# Altium project LimeNet-Micro_2v1-SDR.PrjPcb (part 7 of 10)

## Sheet 14_Clocks.SchDoc: Clocks
size A3; Organization: Lime Microsystems; Address1: Surrey Tech Centre; Address2: Guildford GU2 7YG; Address3: Surrey; Address4: United Kingdom; Revision: v2.1; SheetNumber: 14; SheetTotal: 15
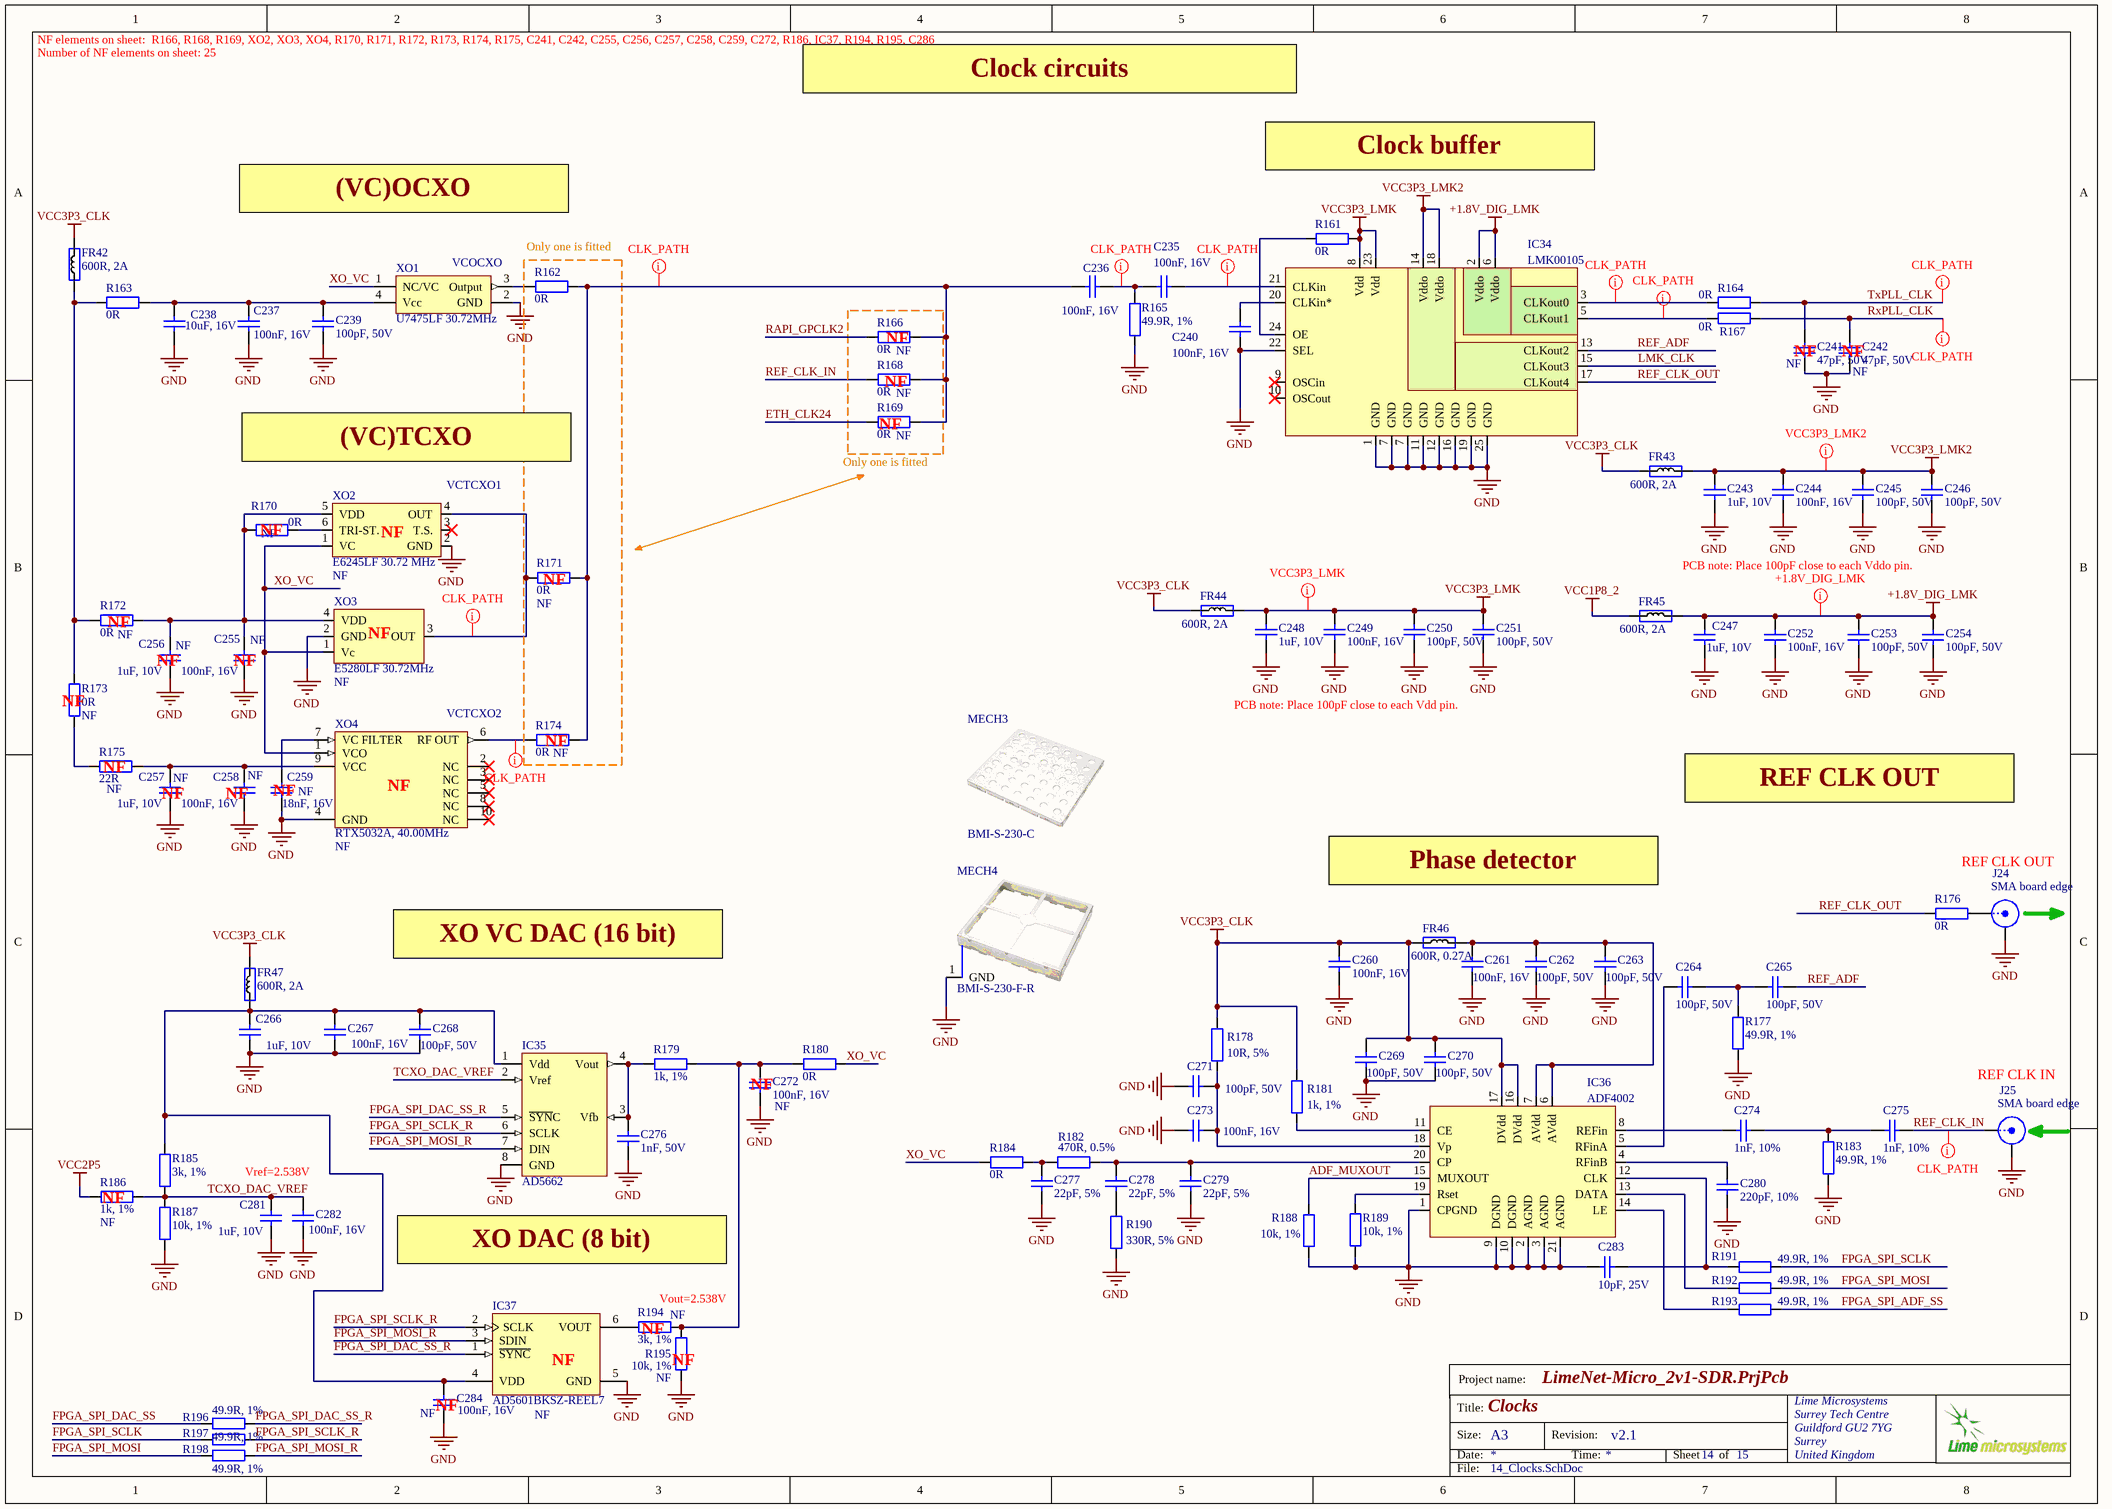
[diagram p13: 14_Clocks.SchDoc]

### Parts
C235  100nF, 16V  [CAP0402]
C236  100nF, 16V  [CAP0402]
C237  100nF, 16V  [CAP0402]
C238  10uF, 16V  [CAP0603]
C239  100pF, 50V  [CAP0402]
C240  100nF, 16V  [CAP0402]
C241  47pF, 50V  Assembly Info: NF  [CAP0402]
C242  47pF, 50V  Assembly Info: NF  [CAP0402]
C243  1uF, 10V  [CAP0402]
C244  100nF, 16V  [CAP0402]
C245  100pF, 50V  [CAP0402]
C246  100pF, 50V  [CAP0402]
C247  1uF, 10V  [CAP0402]
C248  1uF, 10V  [CAP0402]
C249  100nF, 16V  [CAP0402]
C250  100pF, 50V  [CAP0402]
C251  100pF, 50V  [CAP0402]
C252  100nF, 16V  [CAP0402]
C253  100pF, 50V  [CAP0402]
C254  100pF, 50V  [CAP0402]
C255  100nF, 16V  Assembly Info: NF  [CAP0402]
C256  1uF, 10V  Assembly Info: NF  [CAP0402]
C257  1uF, 10V  Assembly Info: NF  [CAP0402]
C258  100nF, 16V  Assembly Info: NF  [CAP0402]
C259  18nF, 16V  Assembly Info: NF  [CAP0402]
C260  100nF, 16V  [CAP0402]
C261  100nF, 16V  [CAP0402]
C262  100pF, 50V  [CAP0402]
C263  100pF, 50V  [CAP0402]
C264  100pF, 50V  [CAP0402]
C265  100pF, 50V  [CAP0402]
C266  1uF, 10V  [CAP0402]
C267  100nF, 16V  [CAP0402]
C268  100pF, 50V  [CAP0402]
C269  100pF, 50V  [CAP0402]
C270  100pF, 50V  [CAP0402]
C271  100pF, 50V  [CAP0402]
C272  100nF, 16V  Assembly Info: NF  [CAP0402]
C273  100nF, 16V  [CAP0402]
C274  1nF, 10%  [CAP0402]
C275  1nF, 10%  [CAP0402]
C276  1nF, 50V  [CAP0402]
C277  22pF, 5%  [CAP0402]
C278  22pF, 5%  [CAP0402]
C279  22pF, 5%  [CAP0402]
C280  220pF, 10%  [CAP0402]
C281  1uF, 10V  [CAP0402]
C282  100nF, 16V  [CAP0402]
C283  10pF, 25V  [CAP0402]
C284  100nF, 16V  Assembly Info: NF  [CAP0402]
FR42  600R, 2A  [RES0805]
FR43  600R, 2A  [RES0805]
FR44  600R, 2A  [RES0805]
FR45  600R, 2A  [RES0805]
FR46  600R, 0.27A  [RES0201]
FR47  600R, 2A  [RES0805]
IC34  LMK00105  [LMK00105SQ]
IC35  AD5662  [AD5662_SOT23-8]
IC36  ADF4002  [ADF4002]
IC37  AD5601BKSZ-REEL7  Assembly Info: NF  [AD5601_SOT23-6]
J24  SMA board edge  [SMA_connector_board_edge_SM]
J25  SMA board edge  [SMA_connector_board_edge_SM]
MECH3  BMI-S-230-C  (mechanical)
MECH4  BMI-S-230-F-R  [RFI_SHIELD_BMI-S-230-F-R]
R161  0R  [RES0402]
R162  0R  [RES0402_v2]
R163  0R  [RES0402]
R164  0R  [RES0402]
R165  49.9R, 1%  [RES0402]
R166  0R  Assembly Info: NF  [RES0402_v2]
R167  0R  [RES0402]
R168  0R  Assembly Info: NF  [RES0402_v2]
R169  0R  Assembly Info: NF  [RES0402_v2]
R170  0R  Assembly Info: NF  [RES0402]
R171  0R  Assembly Info: NF  [RES0402_v2]
R172  0R  Assembly Info: NF  [RES0402]
R173  0R  Assembly Info: NF  [RES0402]
R174  0R  Assembly Info: NF  [RES0402_v2]
R175  22R  Assembly Info: NF  [RES0402]
R176  0R  [RES0402]
R177  49.9R, 1%  [RES0402]
R178  10R, 5%  [RES0402]
R179  1k, 1%  [RES0402]
R180  0R  [RES0402]
R181  1k, 1%  [RES0402]
R182  470R, 0.5%  [RES0402]
R183  49.9R, 1%  [RES0402]
R184  0R  [RES0402]
R185  3k, 1%  [RES0402]
R186  1k, 1%  Assembly Info: NF  [RES0402]
R187  10k, 1%  [RES0402]
R188  10k, 1%  [RES0402]
R189  10k, 1%  [RES0402]
R190  330R, 5%  [RES0402]
R191  49.9R, 1%  [RES0402]
R192  49.9R, 1%  [RES0402]
R193  49.9R, 1%  [RES0402]
R194  3k, 1%  Assembly Info: NF  [RES0402]
R195  10k, 1%  Assembly Info: NF  [RES0402]
R196  49.9R, 1%  [RES0402]
R197  49.9R, 1%  [RES0402]
R198  49.9R, 1%  [RES0402]
XO1  U7475LF 30.72MHz  [AOCJYR-10.000MHz]
XO2  E6245LF 30.72 MHz  Assembly Info: NF  [RAKON_RPT7050A]
XO3  E5280LF 30.72MHz  Assembly Info: NF  [RAKON_TXCO]
XO4  RTX5032A, 40.00MHz  Assembly Info: NF  [RAKON_RTX5032A]

### Blocks framed on the sheet
Only one is fitted: R162 R171 R174

### Nets
+1.8V_DIG_LMK: C247.2 C252.2 C253.2 C254.2 FR45.2 IC34.2(Vddo) IC34.6(Vddo)
GND: C237.1 C238.1 C239.2 C240.1 C241.1 C242.1 C243.1 C244.1 C245.1 C246.1 C247.1 C248.1 C249.1 C250.1 C251.1 C252.1 C253.1 C254.1 C255.1 C256.1 C257.1 C258.1 C259.1 C260.1 C261.1 C262.2 C263.2 C266.1 C267.2 C268.2 C269.2 C270.2 C271.1 C272.1 C273.2 C276.2 C277.1 C279.1 C280.2 C281.1 C282.2 C283.1 C284.2 IC34.1(GND) IC34.7(GND) IC34.11(GND) IC34.12(GND) IC34.16(GND) IC34.19(GND) IC34.22(SEL) IC34.25(GND) IC35.8(GND) IC36.1(CPGND) IC36.2(AGND) IC36.3(AGND) IC36.9(DGND) IC36.10(DGND) IC36.21(AGND) IC37.5(GND) J24.2(Y) J25.2(Y) MECH4.1(GND) R165.1 R177.1 R183.1 R187.2 R188.2 R189.2 R190.1 R195.2 XO1.2(GND) XO2.2(GND) XO3.2(GND) XO4.4(GND)
VCC1P8_2: FR45.1
VCC2P5: R186.2
VCC3P3_CLK: C260.2 C269.1 C270.1 FR42.1 FR43.1 FR44.1 FR46.1 FR47.2 IC36.16(DVdd) IC36.17(DVdd) R178.2 R181.2
VCC3P3_LMK: C248.2 C249.2 C250.2 C251.2 FR44.2 IC34.8(Vdd) IC34.23(Vdd) R161.2
VCC3P3_LMK2: C243.2 C244.2 C245.2 C246.2 FR43.2 IC34.14(Vddo) IC34.18(Vddo)
ADF_MUXOUT: IC36.15(MUXOUT) R188.1
ETH_CLK24: R169.2
FPGA_SPI_ADF_SS: R193.1
FPGA_SPI_DAC_SS: R196.2
FPGA_SPI_DAC_SS_R: IC35.5(~{SYN}C) IC37.1(~{SYNC}) R196.1
FPGA_SPI_MOSI: R192.1 R198.2
FPGA_SPI_MOSI_R: IC35.7(DIN) IC37.3(SDIN) R198.1
FPGA_SPI_SCLK: R191.1 R197.2
FPGA_SPI_SCLK_R: IC35.6(SCLK) IC37.2(SCLK) R197.1
LMK_CLK: IC34.15(CLKout3)
RAPI_GPCLK2: R166.2
REF_ADF: C265.2 IC34.13(CLKout2)
REF_CLK_IN: C275.1 J25.1(X) R168.2
REF_CLK_OUT: IC34.17(CLKout4) R176.2
RxPLL_CLK: C242.2 R167.1
TCXO_DAC_VREF: C281.2 C282.1 IC35.2(Vref) R185.1 R186.1 R187.1
TxPLL_CLK: C241.2 R164.1
XO_VC: R180.1 R184.2 XO1.1(NC/VC) XO2.1(VC) XO3.1(Vc) XO4.1(VCO)
NetC235_1: C235.1 IC34.21(CLKin)
NetC235_2: C235.2 C236.1 R165.2
NetC236_2: C236.2 R162.1 R166.1 R168.1 R169.1 R171.1 R174.2
NetC237_2: C237.2 C238.2 C239.1 R163.2 XO1.4(Vcc)
NetC240_2: C240.2 IC34.20(CLKin*)
NetC255_2: C255.2 C256.2 R170.2 R172.1 XO2.5(VDD) XO3.4(VDD)
NetC257_2: C257.2 C258.2 R175.2 XO4.9(VCC)
NetC259_2: C259.2 XO4.7(VC_FILTER)
NetC261_2: C261.2 C262.1 C263.1 FR46.2 IC36.6(AVdd) IC36.7(AVdd)
NetC264_1: C264.1 IC36.5(RFinA)
NetC264_2: C264.2 C265.1 R177.2
NetC266_2: C266.2 C267.1 C268.1 C284.1 FR47.1 IC35.1(Vdd) IC37.4(VDD) R185.2
NetC271_2: C271.2 C273.1 IC36.18(Vp) R178.1
NetC272_2: C272.2 R179.1 R180.2 R194.1 R195.1
NetC274_1: C274.1 C275.2 R183.2
NetC274_2: C274.2 IC36.8(REFin)
NetC276_1: C276.1 IC35.3(Vfb) IC35.4(Vout) R179.2
NetC277_2: C277.2 R182.2 R184.1
NetC278_1: C278.1 R190.2
NetC278_2: C278.2 C279.2 IC36.20(CP) R182.1
NetC280_1: C280.1 IC36.4(RFinB)
NetC283_2: C283.2 IC36.12(CLK) R191.2
NetFR42_2: FR42.2 R163.1 R172.2 R173.1
NetIC34_3: IC34.3(CLKout0) R164.2
NetIC34_5: IC34.5(CLKout1) R167.2
NetIC34_24: IC34.24(OE) R161.1
NetIC36_11: IC36.11(CE) R181.1
NetIC36_13: IC36.13(DATA) R192.2
NetIC36_14: IC36.14(LE) R193.2
NetIC36_19: IC36.19(Rset) R189.1
NetIC37_6: IC37.6(VOUT) R194.2
NetJ24_1: J24.1(X) R176.1
NetR162_2: R162.2 XO1.3(Output)
NetR170_1: R170.1 XO2.6(TRI-ST.)
NetR171_2: R171.2 XO2.4(OUT) XO3.3(OUT)
NetR173_2: R173.2 R175.1
NetR174_1: R174.1 XO4.6(RF_OUT)

Not connected (* = marked no-connect by the designer): IC34 9(OSCin)* 10(OSCout)*; XO2 3(T.S.)*; XO4 2(NC)* 3(NC)* 5(NC)* 8(NC)* 10(NC)*

### Layout directives
net class CLK_PATH: NetC235_1, NetC235_2, NetC236_2, NetIC34_3, NetIC34_5, NetR171_2, NetR174_1, REF_CLK_IN, RxPLL_CLK, TxPLL_CLK
net class VCC3P3_LMK2: VCC3P3_LMK2
net class VCC3P3_LMK: VCC3P3_LMK
net class +1.8V_DIG_LMK: +1.8V_DIG_LMK

### Notes on the sheet
- NF elements on sheet:  R166, R168, R169, XO2, XO3, XO4, R170, R171, R172, R173, R174, R175, C241, C242, C255, C256, C257, C258, C259, C272, R186, IC37, R194, R195, C286
- Number of NF elements on sheet: 25
- Clock circuits
- Clock buffer
- (VC)OCXO
- (near XO1) VCOCXO
- (near R166) NF
- (near C241) NF
- (near C242) NF
- (near R169) NF
- (near R168) NF
- (VC)TCXO
- (near XO2) VCTCXO1
- (near R169) Only one is fitted
- (near R170) NF
- (near XO2) NF
- (near R171) NF
- PCB note: Place 100pF close to each Vddo pin.
- (near R172) NF
- (near XO3) NF
- (near R173) NF
- (near C256) NF
- (near C255) NF
- (near XO4) VCTCXO2
- PCB note: Place 100pF close to each Vdd pin.
- (near R175) NF
- (near R174) NF
- (near C257) NF
- (near C258) NF
- (near C259) NF
- (near XO4) NF
- REF CLK OUT
- Phase detector
- XO VC DAC (16 bit)
- (near C272) NF
- (near J25) REF CLK IN
- Vref=2.538V
- (near R186) NF
- XO DAC (8 bit)
- Vout=2.538V
- (near IC37) NF
- NF
- (near R195) NF
- (near C284) NF
- Project name:
- Title:
- Size:
- Date:
- A3
- Revision:
- Time:
- Sheet
- of
- File:

### Library data of the parts
C235-C237 C240 C244 C249 C252 C255 C258 C260 C261 C272 C273 = Cap_0402: Manufacturer: Murata Electronics; Manufacturer Part Number: GRM155R71C104KA88D; Part Description: CAP CER 0.1UF 16V X7R 0402; Tolerance: 10 %; Type: General Purpose MLCC; Capacitance: 0.1 uF; Case Length: 1 mm; Dielectric: X7R; Case Height: 0.5 mm; Temperature Coefficient / Code: +/- 15 %; Value: 100nF, 16V; Supplier 1: Mouser; Supplier Part Number 1: 81-GRM155R71C104KA88; Case Code - in: 0402; RoHS: RoHS Compliant; Operating Temperature Range: - 55 C to + 125 C; Series: GRM; Termination Style: SMD/SMT; Package / Case: 0402 (1005 metric); Voltage Rating DC: 16 V; Maximum Operating Temperature: + 125 C; Case Code - mm: 1005; Minimum Operating Temperature: - 55 C; Product Category: Low & Medium Capacitance SMD Ceramic Chip Capacitors; Packaging: Reel; Product: General Type MLCCs; Category: Multilayer Ceramic Capacitors MLCC - SMD/SMT; Brand: Murata Electronics; Case Width: 0.5 mm; RoHS - Mouser: Y; Standard Pack Qty: 10000; Minimum Order Quantity: 1; Reeling: True; Manufacturer Part Number 1: GRM155R71C104KA88D
C238 = Cap_0603: Manufacturer: Yageo; Manufacturer Part Number 1: GRM188R61C106MA73D; Part Description: 10µF ±20% 16V Ceramic Capacitor X5R 0603 (1608 Metric); Temperature Coefficient: X5R; Capacitance: 10µF; Tolerance: ±20%; Value: 10uF, 16V; Supplier 1: Digi-Key; Supplier Part Number 1: 490-7201-2-ND; Category: Capacitors; Ratings: -; Features: -; Lead Style: -; Package / Case: 0603 (1608 Metric); Lead Spacing: -; Applications: General Purpose; Voltage - Rated: 16V; Operating Temperature: -55°C ~ 85°C; Thickness (Max): 0.039" (1.00mm); Mounting Type: Surface Mount, MLCC; RoHS: RoHS Compliant; Size / Dimension: 0.063" L x 0.031" W (1.60mm x 0.80mm); Packaging: Tape & Reel (TR); Height - Seated (Max): -
C239 = Cap_0402: Manufacturer Part Number 1: CC0402JRNPO9BN101; Manufacturer: Yageo; Part Description: 100pF ±5% 50V C0G, NP0 Ceramic Capacitor -55°C ~ 125°C Surface Mount, MLCC 0402 (1005 Metric) 0.039" L x 0.020" W (1.00mm x 0.50mm); Tolerance: ±5%; Temperature Coefficient: C0G, NP0; Value: 100pF, 50V; Capacitance: 100pF; Thickness (Max): 0.022" (0.55mm); Size / Dimension: 0.039" L x 0.020" W (1.00mm x 0.50mm); RoHS: RoHS Compliant; Ratings: -; Package / Case: 0402 (1005 Metric); Mounting Type: Surface Mount, MLCC; Height - Seated (Max): -; Features: -; Lead Spacing: -; Voltage - Rated: 50V; Operating Temperature: -55°C ~ 125°C; Packaging: Cut Tape (CT); Applications: General Purpose; Lead Style: -; Supplier 1: Digi-Key; Category: Capacitors; Supplier Part Number 1: 311-1024-1-ND
C241 C242 = Cap_0402: Manufacturer Part Number 1: C1005C0G1H470F050BA; Manufacturer: TDK Corporation; Part Description: 47pF ±1% 50V C0G, NP0 Ceramic Capacitor -55°C ~ 125°C Surface Mount, MLCC 0402 (1005 Metric) 0.039" L x 0.020" W (1.00mm x 0.50mm); Temperature Coefficient: C0G, NP0; Tolerance: ±1%; Value: 47pF, 50V; Supplier 1: Digi-Key; Supplier Part Number 1: 445-5361-1-ND; Package / Case: 0402 (1005 Metric); Voltage - Rated: 50V; Lead Spacing: -; Ratings: -; Mounting Type: Surface Mount, MLCC; Operating Temperature: -55°C ~ 125°C; Thickness (Max): 0.022" (0.55mm); Capacitance: 47pF; Packaging: Cut Tape (CT); Features: -; Applications: General Purpose; Lead Style: -; Size / Dimension: 0.039" L x 0.020" W (1.00mm x 0.50mm); Height - Seated (Max): -; RoHS: RoHS Compliant; Category: Capacitors
C243 C247 C248 C256 C257 C266 C281 = Cap_0402: CAP CER 1UF 10V X5R 0402; Manufacturer: Yageo; Part Description: 1µF 10V Ceramic Capacitor X5R 0402 (1005 Metric) 0.039" L x 0.020" W (1.00mm x 0.50mm); Manufacturer Part Number 1: CC0402MRX5R6BB105; Notification: Current market demand for these product types have resulted in fluctuating and extending lead times. Lead times may differ.; Tolerance: ±20%; Value: 1uF, 10V; Supplier 1: Digi-Key; Supplier Part Number 1: 311-1732-1-ND; RoHS: RoHS Compliant; Applications: General Purpose; Category: Capacitors; ComponentLink1Description: http://www.yageo.com/documents/recent/UPY-GPHC_X5R_4V-to-50V_25.pdf; ComponentLink1URL: http://www.yageo.com/documents/recent/UPY-GPHC_X5R_4V-to-50V_25.pdf; Failure Rate: -; Features: -; Height - Seated (Max): -; Lead Spacing: -; Lead Style: -; Mounting Type: Surface Mount, MLCC; Operating Temperature: -55°C ~ 85°C; Package / Case: 0402 (1005 Metric); Packaging: Cut Tape (CT); Part Status: Active; Pricing 1: 1=0.22, 10=0.156, 100=0.0732, 500=0.0513, 1000=0.04248, 2500=0.03953, 5000=0.03617 (USD); Ratings: -; Size / Dimension: 0.039" L x 0.020" W (1.00mm x 0.50mm); Stock 1: 69600; Temperature Coefficient: X5R; Thickness (Max): 0.022" (0.55mm); Voltage - Rated: 10V
C245 C246 C250 C251 C253 C254 = Cap_0402: Manufacturer Part Number 1: CC0402JRNPO9BN101; Manufacturer: Yageo; Part Description: 100pF ±5% 50V C0G, NP0 Ceramic Capacitor -55°C ~ 125°C Surface Mount, MLCC 0402 (1005 Metric) 0.039" L x 0.020" W (1.00mm x 0.50mm); Temperature Coefficient: C0G, NP0; Tolerance: ±5%; Value: 100pF, 50V; Supplier 1: Digi-Key; Supplier Part Number 1: 311-1024-1-ND; RoHS: RoHS Compliant; Category: Capacitors; Applications: General Purpose; Mounting Type: Surface Mount, MLCC; Capacitance: 100pF; Ratings: -; Packaging: Cut Tape (CT); Voltage - Rated: 50V; Size / Dimension: 0.039" L x 0.020" W (1.00mm x 0.50mm); Height - Seated (Max): -; Package / Case: 0402 (1005 Metric); Operating Temperature: -55°C ~ 125°C; Features: -; Lead Spacing: -; Lead Style: -; Thickness (Max): 0.022" (0.55mm)
C259 = Cap_0402: Manufacturer: Yageo; Manufacturer Part Number 1: CC0402KRX7R7BB183; Part Description: 0.018µF ±10% 16V Ceramic Capacitor X7R 0402 (1005 Metric); Temperature Coefficient: X7R; Capacitance: 0.018µF; Tolerance: ±10%; Value: 18nF, 16V; Supplier 1: Digi-Key; Supplier Part Number 1: 311-1706-1-ND; Part Status: Active; Category: Capacitors; Packaging: Cut Tape (CT); Voltage - Rated: 16V; RoHS: RoHS Compliant; Size / Dimension: 0.039" L x 0.020" W (1.00mm x 0.50mm); Package / Case: 0402 (1005 Metric); Mounting Type: Surface Mount, MLCC; Thickness (Max): 0.022" (0.55mm); Applications: General Purpose; Operating Temperature: -55°C ~ 125°C
C262-C265 C268-C271 = Cap_0402: Manufacturer: Yageo; Manufacturer Part Number 1: CC0402JRNPO9BN101; Part Description: 100pF ±5% 50V C0G, NP0 Ceramic Capacitor -55°C ~ 125°C Surface Mount, MLCC 0402 (1005 Metric) 0.039" L x 0.020" W (1.00mm x 0.50mm); Temperature Coefficient: C0G, NP0; Tolerance: ±5%; Value: 100pF, 50V; Supplier 1: Digi-Key; Supplier Part Number 1: 311-1024-1-ND; Category: Capacitors; Features: -; Operating Temperature: -55°C ~ 125°C; Capacitance: 100pF; Thickness (Max): 0.022" (0.55mm); RoHS: RoHS Compliant; Voltage - Rated: 50V; Lead Style: -; Ratings: -; Size / Dimension: 0.039" L x 0.020" W (1.00mm x 0.50mm); Height - Seated (Max): -; Applications: General Purpose; Package / Case: 0402 (1005 Metric); Lead Spacing: -; Packaging: Cut Tape (CT); Mounting Type: Surface Mount, MLCC
C267 C282 = Cap_0603: Manufacturer Part Number 1: GRM155R71C104KA88D; Part Description: CAP CER 0.1UF 16V X7R 0402; Brand: Murata Electronics; Tolerance: 10 %; Type: General Purpose MLCC; Capacitance: 0.1 uF; Temperature Coefficient / Code: +/- 15 %; Case Height: 0.5 mm; Case Length: 1 mm; Dielectric: X7R; Supplier 1: Mouser; Supplier Part Number 1: 81-GRM155R71C104KA88; Case Code - in: 0402; Manufacturer: Murata Electronics; Category: Multilayer Ceramic Capacitors MLCC - SMD/SMT; Voltage Rating DC: 16 V; Value: 100nF, 16V; Manufacturer Part Number: GRM155R71C104KA88D; Case Code - mm: 1005; Case Width: 0.5 mm; Maximum Operating Temperature: + 125 C; Minimum Operating Temperature: - 55 C; Minimum Order Quantity: 1; Operating Temperature Range: - 55 C to + 125 C; Package / Case: 0402 (1005 metric); Packaging: Reel; Product: General Type MLCCs; Product Category: Low & Medium Capacitance SMD Ceramic Chip Capacitors; Reeling: True; RoHS - Mouser: Y; RoHS: RoHS Compliant; Series: GRM; Standard Pack Qty: 10000; Termination Style: SMD/SMT
C274 C275 = Cap_0402: Manufacturer Part Number 1: GCM155R71H102KA37D; Part Description: 1000pF ±10% 50V X7R Ceramic Capacitor -55°C ~ 125°C Surface Mount, MLCC 0402 (1005 Metric) 0.039" L x 0.020" W (1.00mm x 0.50mm); Capacitance: 1000 pF; Type: Automotive Ultra Small MLCC; Brand: Murata Electronics; Case Height: 0.5 mm; Case Length: 1 mm; Dielectric: X7R; Voltage Rating DC: 50 V; Temperature Coefficient / Code: +/- 15 %; Value: 1nF, 10%; Supplier 1: Mouser; Supplier Part Number 1: 81-GCM155R71H102KA7D; Case Code - in: 0402; Package / Case: 0402 (1005 metric); Tolerance: 10 %; Termination Style: SMD/SMT; Packaging: Reel; Operating Temperature Range: - 55 C to + 125 C; Maximum Operating Temperature: + 125 C; Manufacturer: Murata Electronics; Category: Multilayer Ceramic Capacitors MLCC - SMD/SMT; RoHS: RoHS Compliant; Series: GCM; Case Width: 0.5 mm; Case Code - mm: 1005; Product: Automotive MLCCs; Standard Pack Qty: 10000; Reeling: True; RoHS - Mouser: Y; Minimum Order Quantity: 1; Product Category: Automotive Ceramic Chip Capacitors; Minimum Operating Temperature: - 55 C
C276 = Cap_0402: Manufacturer: Murata Electronics North America; Part Description: 1000pF ±10% 50V Ceramic Capacitor X7R 0402 (1005 Metric); Manufacturer Part Number 1: GCM155R71H102KA37D; Temperature Coefficient: X7R; Tolerance: ±10%; Height - Seated (Max): -; Operating Temperature: -55°C ~ 125°C; Ratings: AEC-Q200; Package / Case: 0402 (1005 Metric); Lead Style: -; Size / Dimension: 0.039" L x 0.020" W (1.00mm x 0.50mm); Lead Spacing: -; Thickness (Max): 0.022" (0.55mm); Mounting Type: Surface Mount, MLCC; Features: -; Voltage - Rated: 50V; Applications: Automotive; Part Status: Active; Packaging: Cut Tape (CT); RoHS: RoHS Compliant; Category: Capacitors; Supplier Part Number 1: 490-4761-1-ND; Supplier 1: Digi-Key; Value: 1nF, 50V
C277-C279 = Cap_0402: Manufacturer: Yageo; Manufacturer Part Number 1: CC0402JRNPO9BN220; Part Description: 22pF ±5% 50V C0G, NP0 Ceramic Capacitor -55°C ~ 125°C Surface Mount, MLCC 0402 (1005 Metric) 0.039" L x 0.020" W (1.00mm x 0.50mm); Voltage - Rated: 50V; Temperature Coefficient: C0G, NP0; Value: 22pF, 5%; Supplier 1: Digi-Key; Supplier Part Number 1: 311-1018-2-ND; Tolerance: ±5%; Category: Capacitors; Packaging: Tape & Reel (TR); RoHS: RoHS Compliant; Capacitance: 22pF; Operating Temperature: -55°C ~ 125°C; Mounting Type: Surface Mount, MLCC; Height - Seated (Max): -; Size / Dimension: 0.039" L x 0.020" W (1.00mm x 0.50mm); Ratings: -; Applications: General Purpose; Thickness (Max): 0.022" (0.55mm); Lead Spacing: -; Lead Style: -; Features: -; Package / Case: 0402 (1005 Metric)
C280 = Cap_0402: Manufacturer Part Number 1: CC0402KRX7R9BB221; Manufacturer: Yageo; Part Description: 220pF ±10% 50V X7R Ceramic Capacitor -55°C ~ 125°C Surface Mount, MLCC 0402 (1005 Metric) 0.039" L x 0.020" W (1.00mm x 0.50mm); Temperature Coefficient: X7R; Voltage - Rated: 50V; Value: 220pF, 10%; Supplier 1: Digi-Key; Supplier Part Number 1: 311-1035-2-ND; Category: Capacitors; Ratings: -; RoHS: RoHS Compliant; Packaging: Tape & Reel (TR); Mounting Type: Surface Mount, MLCC; Applications: General Purpose; Capacitance: 220pF; Tolerance: ±10%; Operating Temperature: -55°C ~ 125°C; Package / Case: 0402 (1005 Metric); Lead Spacing: -; Size / Dimension: 0.039" L x 0.020" W (1.00mm x 0.50mm); Thickness (Max): 0.022" (0.55mm); Height - Seated (Max): -; Lead Style: -; Features: -
C283 = Cap_0402: Manufacturer Part Number 1: 04023A100JAT2A; Manufacturer: AVX; Part Description: 10pF ±5% 25V C0G, NP0 Ceramic Capacitor -55°C ~ 125°C Surface Mount, MLCC 0402 (1005 Metric) 0.039" L x 0.020" W (1.00mm x 0.50mm); Capacitance Tolerance: ± 5%; Voltage Rating: 25; Ceramic Capacitor Case: 0402 [1005 Metric]; Capacitor Case Style: 0402 [1005 Metric]<!--FANDB--><div class="features-and-benefits-container"></div>; Dielectric Characteristic: C0G / NP0; SVHC: No SVHC (16-Jun-2014); Capacitance: 10; Value: 10pF, 25V; Supplier 1: Farnell; Supplier Part Number 1: 2332478RL; Product Range: -; RoHS: YES; Operating Temperature Min: -55; Operating Temperature Max: 125; Capacitance Tolerance ±: ± 5%; MSL: MSL 1 - Unlimited; Packaging: Cut Tape
C284 = Cap_0603: as C212 on sheet 13_Raspberry_Misc; Supplier 1: Mouser; Supplier Part Number 1: 81-GRM155R71C104KA88; Case Code - in: 0402; Manufacturer: Murata Electronics; Category: Multilayer Ceramic Capacitors MLCC - SMD/SMT; Voltage Rating DC: 16 V; Value: 100nF, 16V; Manufacturer Part Number: GRM155R71C104KA88D
FR42 = Ferrite: Manufacturer Part Number 1: MPZ2012S601AT000; Manufacturer: TDK Corporation; Part Description: FERRITE BEAD 600 OHM 0805 1LN; DC Resistance (DCR): 100 mOhm Max; Filter Type: Differential Mode - Single; Impedance @ Frequency: 600 Ohm @ 100MHz; Supplier 1: Digi-Key; Supplier Part Number 1: 445-2206-2-ND; Value: 600R, 2A; Category: Filters; Current Rating: 2A; Height (Max): 0.041" (1.05mm); Mounting Type: Surface Mount; Package / Case: 0805 (2012 Metric); Packaging: Tape & Reel (TR); RoHS: RoHS Compliant; Size / Dimension: 0.079" L x 0.049" W (2.00mm x 1.25mm)
FR43-FR45 FR47 = Ferrite: Manufacturer Part Number 1: MPZ2012S601AT000; Manufacturer: TDK Corporation; Part Description: FERRITE BEAD 600 OHM 0805 1LN; Filter Type: Differential Mode - Single; Impedance @ Frequency: 600 Ohm @ 100MHz; DC Resistance (DCR): 100 mOhm Max; Supplier 1: Digi-Key; Supplier Part Number 1: 445-2206-2-ND; Mounting Type: Surface Mount; RoHS: RoHS Compliant; Height (Max): 0.041" (1.05mm); Packaging: Tape & Reel (TR); Category: Filters; Current Rating: 2A; Package / Case: 0805 (2012 Metric); Size / Dimension: 0.079" L x 0.049" W (2.00mm x 1.25mm); Value: 600R, 2A
FR46 = Ferrite: Manufacturer Part Number 1: BK0603TS601-T; Manufacturer: Taiyo Yuden; Part Description: FERRITE BEAD 600 OHM 0201 1LN; DC Resistance (DCR): 750 mOhm Max; Filter Type: Differential Mode - Single; Impedance @ Frequency: 600 Ohm @ 100MHz; Current Rating: 270mA; Supplier 1: Digi-Key; Supplier Part Number 1: 587-3277-1-ND; Size / Dimension: 0.024" L x 0.012" W (0.60mm x 0.30mm); Package / Case: 0201 (0603 Metric); Height (Max): 0.013" (0.33mm); Mounting Type: Surface Mount; Packaging: Cut Tape (CT); RoHS: RoHS Compliant; Category: Filters; Value: 600R, 0.27A
IC34 = LMK00105: Manufacturer: Texas Instruments; Manufacturer Part Number 1: LMK00105SQ/NOPB; Part Description: IC CLK BUFFER 2:5 200MHZ 24WQFN; Frequency - Max: 200MHz; Voltage - Supply: 2.375 V ~ 3.45 V; Input: HCSL, LVCMOS, LVDS, LVPECL, LVTTL, SSTL, Crystal; Differential - Input:Output: Yes/No; Supplier 1: Digi-Key; Type: Fanout Buffer (Distribution), Multiplexer, Translator; Category: Integrated Circuits (ICs); Operating Temperature: -40°C ~ 85°C; Package / Case: 24-WFQFN Exposed Pad; Supplier Device Package: 24-WQFN (4x4); Supplier Part Number 1: LMK00105SQ/NOPBCT-ND
IC35 = AD5662: Manufacturer: Analog Devices Inc.; Manufacturer Part Number 1: AD5662BRJZ-2REEL7; Part Description: IC DAC 16BIT BUFF V-OUT SOT23-8; Number of Bits: 16; Number of D/A Converters: 1; Settling Time: 10µs; Output Type: Voltage - Buffered; Differential Output: No; Data Interface: SPI, DSP; Reference Type: External; Voltage - Supply, Analog: 2.7 V ~ 5.5 V; INL/DNL (LSB): ±8, ±1 (Max); Architecture: String DAC; Supplier 1: Digi-Key; RoHS: RoHS Compliant; Category: Integrated Circuits (ICs); Stock 1: 2784; Pricing 1: 1=7.55, 10=6.821, 100=5.6469, 500=4.91722, 1000=4.28274 (USD); Packaging: Cut Tape (CT); Part Status: Active; Voltage - Supply, Digital: 2.7 V ~ 5.5 V; Operating Temperature: -40°C ~ 125°C; Package / Case: SOT-23-8; Supplier Device Package: SOT-23-8; ComponentLink1URL: http://www.analog.com/media/en/technical-documentation/data-sheets/AD5662.pdf; ComponentLink1Description: http://www.analog.com/media/en/technical-documentation/data-sheets/AD5662.pdf; Supplier Part Number 1: AD5662BRJZ-2REEL7CT-ND
IC36 = ADF4002: Manufacturer: Analog Devices Inc; Manufacturer Part Number 1: ADF4002BCPZ-RL7; Part Description: IC PLL FREQUENCY SYNTH 20-LFCSP; Ratio - Input:Output: 2:1; Differential - Input:Output: Yes/No; Input: CMOS, TTL; Voltage - Supply: 2.7 V ~ 3.3 V; Supplier 1: Digi-Key; Supplier: Digi-Key; Category: Integrated Circuits (ICs); Type: Clock/Frequency Synthesizer (RF), Phase Detector; Operating Temperature: -40°C ~ 85°C; Mounting Type: Surface Mount; Package / Case: 20-VFQFN Exposed Pad, CSP; Supplier Part Number 1: ADF4002BCPZ-RL7CT-ND
IC37 = AD5601BKSZ-REEL7: Single 8-Bit nanoDAC with SPI Interface in LFCSP and SC70, 2.7 to 5.5 V, <100 uA, -40 to +125 degC, KS-6, Pb-Free, Reel; Generic Part Number: AD5601; Manufacturer: Analog Devices; Part Description: IC DAC 8BIT BUFF V-OUT SC70-6; # DAC Outputs: 1; Max V+: 5.5V; Op Pwr Diss: 550µW; Resolution (Bits): 8; Settling Time: 6µs; Single Supply: Yes; DatasheetVersion: Rev.F; PackageVersion: 072809-A; PackageReference: KS-6; PackageDescription: 6-Lead Thin Shrink Small Outline Transistor Package [SC70]; Supplier 1: Digi-Key; Supplier Part Number 1: AD5601BKSZ-REEL7TR-ND; Supplier 2: Digi-Key; Supplier Part Number 2: AD5601BKSZ-REEL7CT-ND; Supplier 3: Digi-Key; Supplier Part Number 3: AD5601BKSZ-REEL7DKR-ND; Supplier 4: Farnell; Supplier Part Number 4: 2312971; Supplier 5: Newark; Supplier Part Number 5: 59K4256; Supplier 6: Newark; Supplier Part Number 6: 67W3160; Supplier 7: Mouser; Supplier Part Number 7: 584-AD5601BKSZ-R7; Packing: Reel; RoHS: Y; Mounting Technology: Surface Mount; Code_JEDEC: MO-203-AB; PartNumber: AD5601BKSZ-REEL7; ComponentLink1Description: Manufacturer URL; ComponentLink1URL: http://www.analog.com/en/index.html; ComponentLink2Description: Datasheet; ComponentLink2URL: http://www.analog.com/static/imported-files/data_sheets/AD5601_5611_5621.pdf; ComponentLink3Description: Package Specification; ComponentLink3URL: http://www.analog.com/static/imported-files/packages/PKG_PDF/SC70(KS)/KS_6.pdf; ComponentLink4Description: Product URL; ComponentLink4URL: http://www.analog.com/en/digital-to-analog-converters/da-converters/ad5601/products/product.html; Manufacturer Part Number 1: AD5601BKSZ-REEL7
J24 J25 = RF_IF_connector: CONN SMA JACK STR 50OHM EDGE MNT; Manufacturer: RF Solutions; Manufacturer Part Number 1: CON-SMA-EDGE-S; Part Description: SMA Connector Jack, Female Socket Board Edge, End Launch Solder; Connector Type: Jack, Female Socket; Contact Termination: Solder; Supplier 1: Digi-Key; Supplier Part Number 1: CON-SMA-EDGE-S-ND; RoHS: RoHS Compliant; Category: Connectors, Interconnects; Stock 1: 1751; Pricing 1: 1=2.1 (USD); Packaging: -; Part Status: Active; Connector Style: SMA; Shield Termination: Solder; Impedance: -; Mounting Type: Board Edge, End Launch; Mounting Feature: -; Cable Group: -; Fastening Type: Threaded; Frequency - Max: -; Features: -; Housing Color: -; Ingress Protection: -; Includes: -; Body Material: -; Body Finish: -; Center Contact Plating: -; Dielectric Material: -; Operating Temperature: -; Center Contact Material: -; Voltage Rating: -; Mating Cycles: -; Insertion Loss: -; ComponentLink1URL: http://media.digikey.com/pdf/Data%20Sheets/RF%20Solutions%20PDFs/CON-SMA-EDGE.pdf; ComponentLink1Description: http://media.digikey.com/pdf/Data%20Sheets/RF%20Solutions%20PDFs/CON-SMA-EDGE.pdf
MECH3 = RFI_SHIELD_2_cover: Part Description: RF Shield Cover 2.000" (50.80mm) X 1.500" (38.10mm) Vent Holes in Pattern Snap Fit; Manufacturer: Laird Technologies EMI; Ventilation: Vent Holes in Pattern; Supplier 1: Digi-Key; Supplier Part Number 1: 903-1471-ND; Manufacturer Part Number 1: BMI-S-230-C; RoHS: RoHS Compliant; Category: RF/IF and RFID; Stock 1: 15865; Pricing 1: 1=1.51, 10=1.333, 25=1.2044, 100=1.0537, 250=0.92472, 500=0.8172, 1000=0.64515, 2500=0.60214, 5000=0.57203 (USD); Packaging: Bulk; Part Status: Active; Type: Cover; Height - Overall: 0.200" (5.08mm); Length - Overall: 1.500" (38.10mm); Width - Overall: 2.000" (50.80mm); Mounting Type: Snap Fit; ComponentLink1URL: https://media.digikey.com/pdf/Data%20Sheets/Laird%20Technologies/BMI-S-230-C_Dwg.pdf; ComponentLink1Description: https://media.digikey.com/pdf/Data%20Sheets/Laird%20Technologies/BMI-S-230-C_Dwg.pdf
MECH4 = RFI_SHIELD_2_frame: Part Description: RF Shield Frame 2.000" (50.80mm) X 1.500" (38.10mm) Solder; Manufacturer: Laird Technologies EMI; Supplier 1: Digi-Key; Supplier Part Number 1: 903-1470-1-ND; Manufacturer Part Number 1: BMI-S-230-F-R; RoHS: RoHS Compliant; Category: RF/IF and RFID; Stock 1: 12638; Pricing 1: 1=1.95, 10=1.726, 25=1.5588 (USD); Packaging: Cut Tape (CT); Part Status: Active; Type: Frame; Height - Overall: 0.200" (5.08mm); Length - Overall: 1.500" (38.10mm); Width - Overall: 2.000" (50.80mm); Ventilation: -; Mounting Type: Solder; ComponentLink1URL: https://media.digikey.com/pdf/Data%20Sheets/Laird%20Technologies/BMI-S-230-F_Dwg.pdf; ComponentLink1Description: https://media.digikey.com/pdf/Data%20Sheets/Laird%20Technologies/BMI-S-230-F_Dwg.pdf
R161-R164 R166-R174 R176 R180 R184 = Res_0402: Manufacturer Part Number 1: RC0402JR-070RL; Manufacturer: Yageo; Part Description: RES SMD 0.0OHM JUMPER 1/16W 0402; Resistance (Ohms): 0.0; Tolerance: Jumper; Power (Watts): 0.063W, 1/16W; Value: 0R; Supplier 1: Digi-Key; Supplier Part Number 1: 311-0.0JRTR-ND; Category: Resistors; Temperature Coefficient: -; Features: Moisture Resistant; Supplier Device Package: 0402; Height: 0.016" (0.40mm); Package / Case: 0402 (1005 Metric); Operating Temperature: -55°C ~ 155°C; Size / Dimension: 0.039" L x 0.020" W (1.00mm x 0.50mm); Composition: Thick Film; Packaging: Tape & Reel (TR); Number of Terminations: 2; RoHS: RoHS Compliant
R165 R177 R183 R191-R193 R196-R198 = Res_0402: Manufacturer: Samsung Electro-Mechanics America, Inc.; Part Description: RES SMD 49.9 OHM 1% 1/16W 0402; Manufacturer Part Number 1: RC1005F49R9CS; Temperature Coefficient: ±100ppm/°C; Resistance (Ohms): 49.9; Power (Watts): 0.063W, 1/16W; Number of Terminations: 2; Size / Dimension: 0.039" L x 0.020" W (1.00mm x 0.50mm); Supplier Device Package: 0402 (1005 Metric); RoHS: RoHS Compliant; Supplier Part Number 1: 1276-3469-6-ND; Features: -; Packaging: Digi-Reel®; Tolerance: ±1%; Height: 0.016" (0.40mm); Category: Resistors; Composition: Thick Film; Package / Case: 0402 (1005 Metric); Supplier 1: Digi-Key; Operating Temperature: -55°C ~ 155°C; Value: 49.9R, 1%
R175 = Res_0402: as R135-R137 on sheet 13_Raspberry_Misc; Supplier 1: Digi-Key; Supplier Part Number 1: 311-22.0LRTR-ND; Supplier Device Package: 0402; Composition: Thick Film; Category: Resistors; Value: 22R
R178 = Res_0402: Manufacturer Part Number 1: RC0402JR-0710RL; Manufacturer: Yageo; Part Description: RES SMD 10 OHM 5% 1/16W 0402; Power (Watts): 0.063W, 1/16W; Resistance (Ohms): 10; Temperature Coefficient: ±200ppm/°C; Value: 10R, 5%; Supplier 1: Digi-Key; Supplier Part Number 1: 311-10JRTR-ND; Number of Terminations: 2; Height: 0.016" (0.40mm); RoHS: RoHS Compliant; Composition: Thick Film; Packaging: Tape & Reel (TR); Category: Resistors; Supplier Device Package: 0402; Features: Moisture Resistant; Tolerance: ±5%; Operating Temperature: -55°C ~ 155°C; Size / Dimension: 0.039" L x 0.020" W (1.00mm x 0.50mm); Package / Case: 0402 (1005 Metric)
R179 R181 R186 = Res_0402: Manufacturer: Stackpole Electronics Inc; Manufacturer Part Number 1: RMCF0402FT1K00; Part Description: RES SMD 1K OHM 1% 1/16W 0402; Temperature Coefficient: ±100ppm/°C; Power (Watts): 0.063W, 1/16W; Value: 1k, 1%; Supplier 1: Digi-Key; Supplier Part Number 1: RMCF0402FT1K00TR-ND; Resistance (Ohms): 1k; Packaging: Tape & Reel (TR); Category: Resistors; RoHS: RoHS Compliant; Tolerance: ±1%; Height: 0.016" (0.40mm); Number of Terminations: 2; Package / Case: 0402 (1005 Metric); Operating Temperature: -55°C ~ 155°C; Features: -; Composition: Thick Film; Supplier Device Package: 0402; Size / Dimension: 0.039" L x 0.020" W (1.00mm x 0.50mm)
R182 = Res_0402: Manufacturer: Panasonic Electronic Components; Manufacturer Part Number 1: ERA-2AED471X; Part Description: RES SMD 470 OHM 0.5% 1/16W 0402; Power (Watts): 0.063W, 1/16W; Temperature Coefficient: ±25ppm/°C; Resistance (Ohms): 470; Value: 470R, 0.5%; Supplier 1: Digi-Key; Supplier Part Number 1: P470DETR-ND; Tolerance: ±0.5%; Packaging: Tape & Reel (TR); Number of Terminations: 2; Operating Temperature: -55°C ~ 155°C; RoHS: RoHS Compliant; Size / Dimension: 0.039" L x 0.020" W (1.00mm x 0.50mm); Composition: Thin Film; Package / Case: 0402 (1005 Metric); Height: 0.016" (0.40mm); Features: Automotive AEC-Q200; Supplier Device Package: 0402; Category: Resistors
R185 R194 = Res_0402: Manufacturer: Vishay Dale; Part Description: RES SMD 3K OHM 1% 1/16W 0402; Manufacturer Part Number 1: CRCW04023K00FKED; Temperature Coefficient: ±100ppm/°C; Power (Watts): 0.063W, 1/16W; Value: 3k, 1%; Category: Resistors; Tolerance: ±1%; RoHS: RoHS Compliant; Composition: Thick Film; Number of Terminations: 2; Operating Temperature: -55°C ~ 155°C; Supplier Device Package: 0402 (1005 Metric); Supplier Part Number 1: 541-3.00KLCT-ND; Packaging: Cut Tape (CT); Supplier 1: Digi-Key; Package / Case: 0402 (1005 Metric); Features: Automotive AEC-Q200; Resistance (Ohms): 3k; Height: 0.016" (0.40mm); Size / Dimension: 0.039" L x 0.020" W (1.00mm x 0.50mm)
R187-R189 R195 = Res_0402: Manufacturer: Yageo; Manufacturer Part Number 1: RC0402FR-0710KL; Part Description: RES SMD 10K OHM 1% 1/16W 0402; Temperature Coefficient: ±100ppm/°C; Power (Watts): 0.063W, 1/16W; Value: 10k, 1%; Supplier 1: Digi-Key; Supplier Part Number 1: 311-10.0KLRTR-ND; Resistance (Ohms): 10k; Packaging: Tape & Reel (TR); RoHS: RoHS Compliant; Package / Case: 0402 (1005 Metric); Tolerance: ±1%; Operating Temperature: -55°C ~ 155°C; Size / Dimension: 0.039" L x 0.020" W (1.00mm x 0.50mm); Number of Terminations: 2; Category: Resistors; Height: 0.016" (0.40mm); Supplier Device Package: 0402; Features: Moisture Resistant; Composition: Thick Film
R190 = Res_0402: Manufacturer: Yageo; Manufacturer Part Number 1: RC0402JR-07330RL; Part Description: RES SMD 330 OHM 5% 1/16W 0402; Power (Watts): 0.063W, 1/16W; Resistance (Ohms): 330; Temperature Coefficient: ±100ppm/°C; Value: 330R, 5%; Supplier 1: Digi-Key; Supplier Part Number 1: 311-330JRTR-ND; Composition: Thick Film; Supplier Device Package: 0402; Package / Case: 0402 (1005 Metric); Size / Dimension: 0.039" L x 0.020" W (1.00mm x 0.50mm); Features: Moisture Resistant; Height: 0.016" (0.40mm); Packaging: Tape & Reel (TR); RoHS: RoHS Compliant; Tolerance: ±5%; Category: Resistors; Number of Terminations: 2; Operating Temperature: -55°C ~ 155°C
XO1 = AOCJYR-10.000MHz: Manufacturer: Rakon; Part Description: ROM9070SA 30.72MHz MERC+ 9x7 HOT RC2.5 3.3V PULL; Oscillator Output Compatibility: CMOS; Oscillator Case: SMD, 9.7mm x 7.5; Supply Voltage Nom: 3.3; Frequency Nom, MHz: 30.72; Frequency Stability +/-, ppb: 20; Manufacturer Part Number 1: U7475LF 30.72MHz; Supplier Part Number 1: U7475LF; Supplier 1: Rakon
XO2 = RPT7050A: Part Description: TCXO 30.72MHz, E6245LF; Manufacturer: Rakon; Manufacturer Part Number 1: E6245LF; Supplier 1: Rakon; Supplier Part Number 1: E6245LF
XO3 = TXCO: Part Description: TCXO 30.72MHz, E5280LF; Manufacturer: Rakon; Manufacturer Part Number 1: E5280LF; Supplier 1: Rakon; Supplier Part Number 1: E5280LF
XO4 = Rakon_RTX5032A: Part Description: RTX5032A 40MHz, High performance TCXO, With VC, Filter Enabled, 10-pin 5mm x 3.2 mm x 1.65 mm package; Manufacturer: Rakon; Manufacturer Part Number 1: RTX5032A; Supplier Part Number 1: RTX5032A; Supplier 1: RAKON

## Sheet 15_PowerSupply.SchDoc: Board power supply
size A3; Organization: Lime Microsystems; Address1: Surrey Tech Centre; Address2: Guildford GU2 7YG; Address3: Surrey; Address4: United Kingdom; Revision: v2.1; SheetNumber: 15; SheetTotal: 15
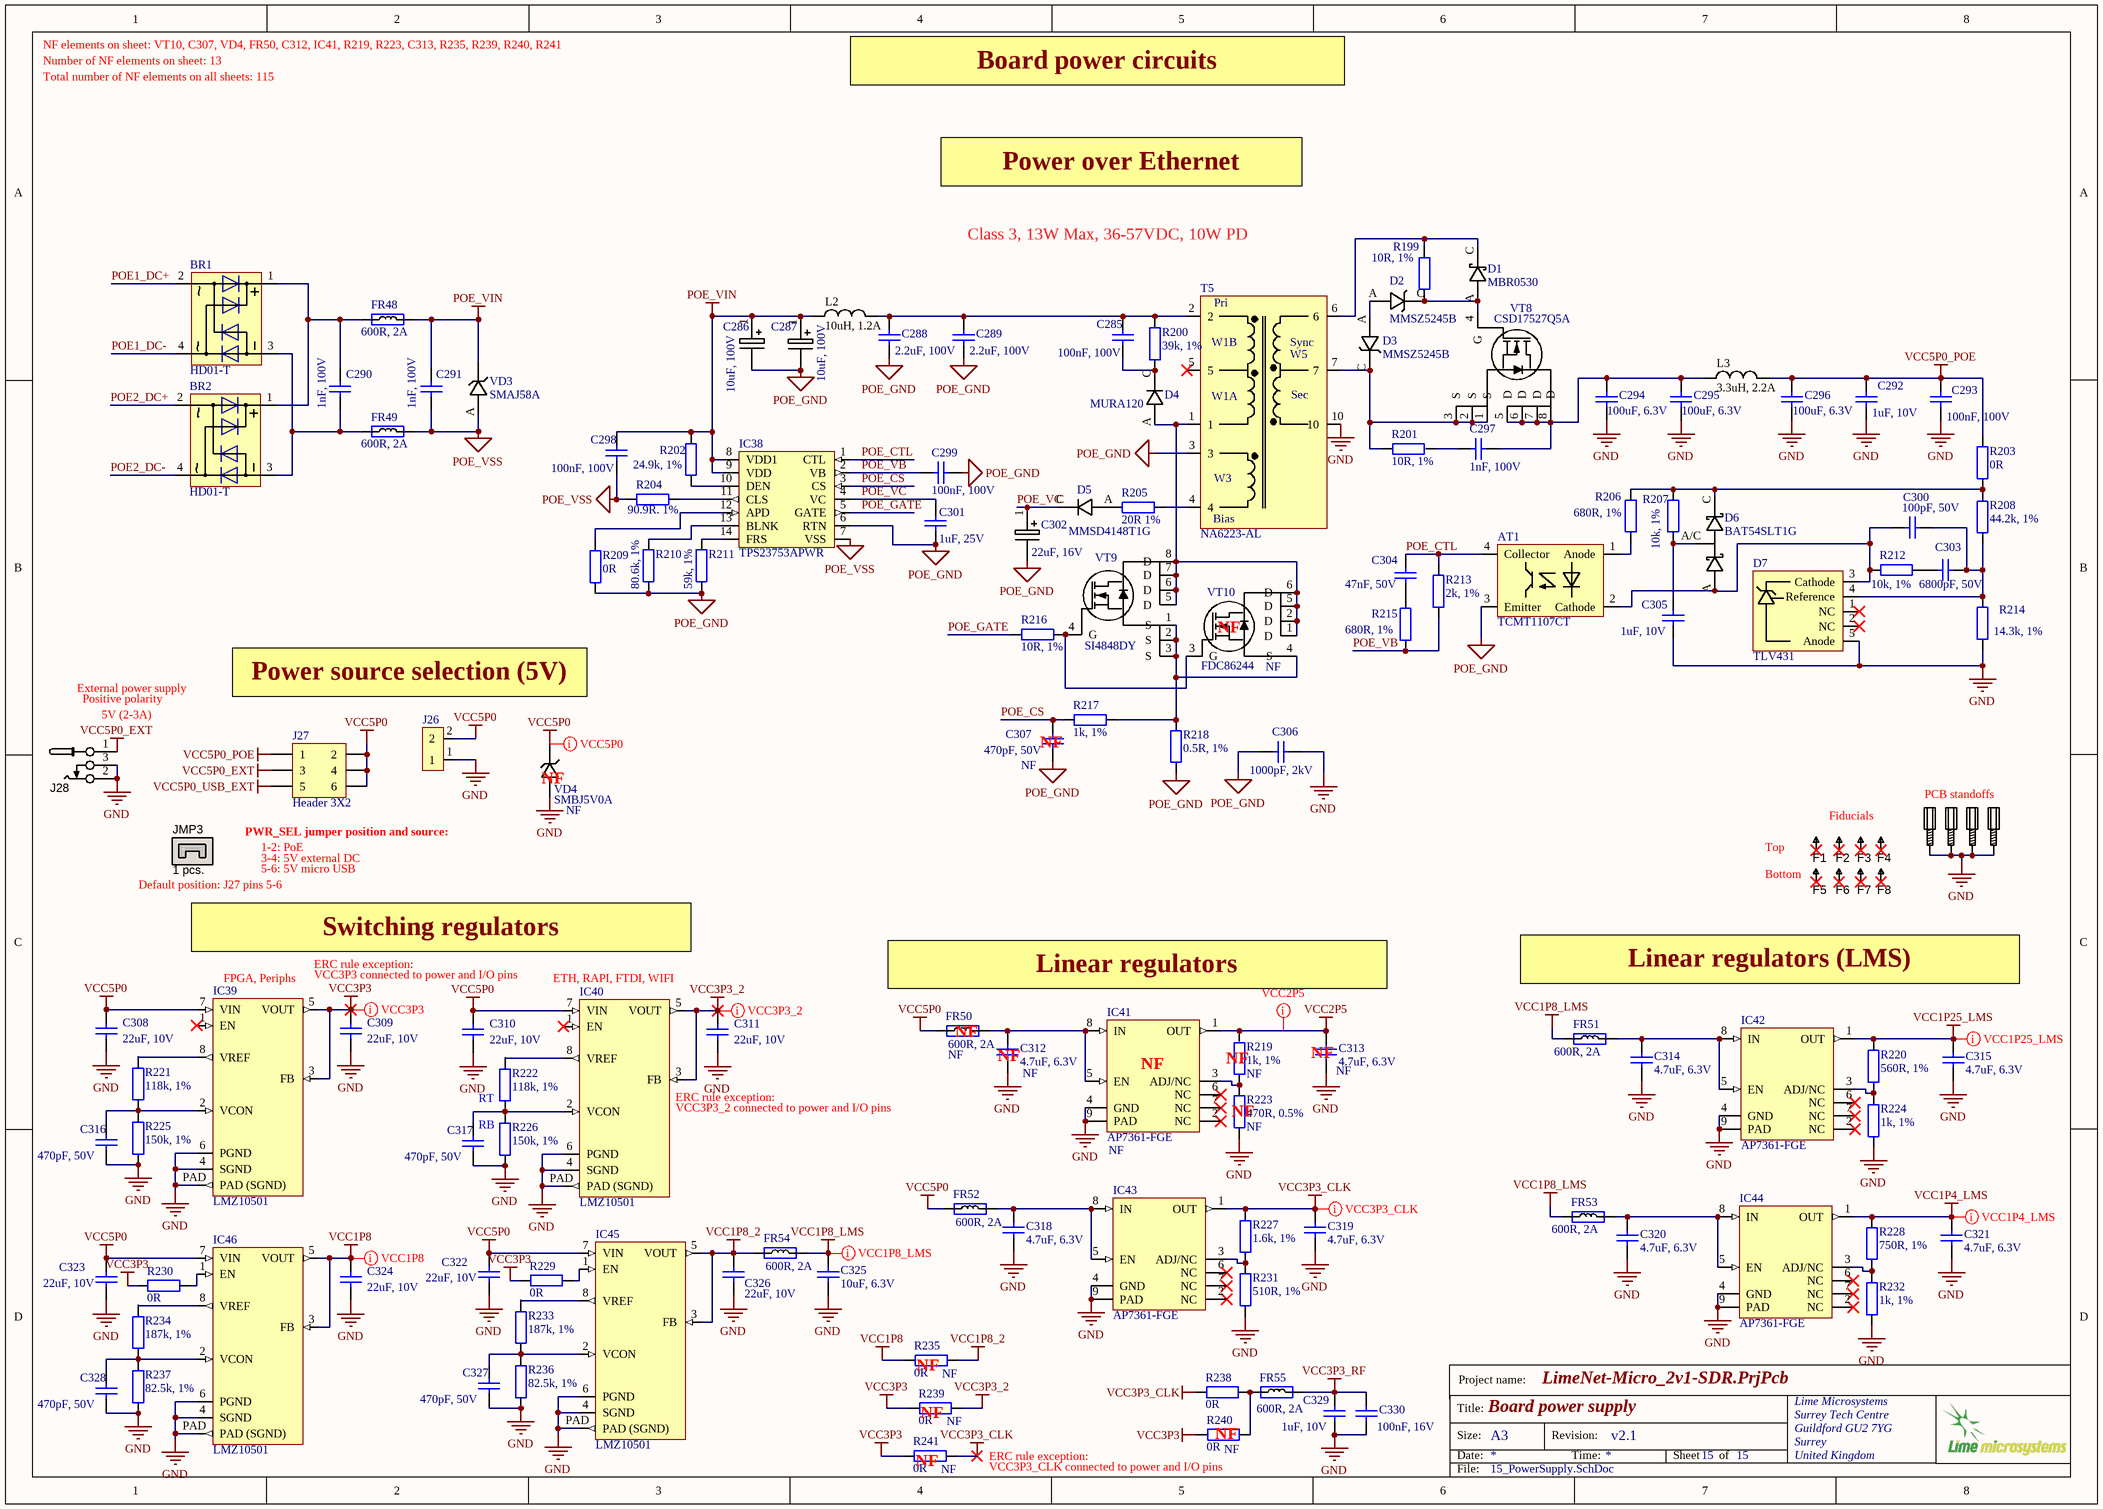
[diagram p14: 15_PowerSupply.SchDoc]

### Parts
AT1  TCMT1107CT  [TCMT1107CT_optoisolator]
BR1  HD01-T  [HD01-T _RECTIFIER_BRIDGE_v1]
BR2  HD01-T  [HD01-T _RECTIFIER_BRIDGE_v1]
C285  100nF, 100V  [CAP0603]
C286  10uF, 100V  [CAP_POL_SIZE_E]
C287  10uF, 100V  [CAP_POL_SIZE_E]
C288  2.2uF, 100V  [CAP1206]
C289  2.2uF, 100V  [CAP1206]
C290  1nF, 100V  [CAP0603]
C291  1nF, 100V  [CAP0603]
C292  1uF, 10V  [CAP0402]
C293  100nF, 100V  [CAP0603]
C294  100uF, 6.3V  [CAP1210]
C295  100uF, 6.3V  [CAP1210]
C296  100uF, 6.3V  [CAP1210]
C297  1nF, 100V  [CAP0603]
C298  100nF, 100V  [CAP0603]
C299  100nF, 100V  [CAP0603]
C300  100pF, 50V  [CAP0402]
C301  1uF, 25V  [CAP0603]
C302  22uF, 16V  [CAP_POL_SIZE_B]
C303  6800pF, 50V  [CAP0402]
C304  47nF, 50V  [CAP0603]
C305  1uF, 10V  [CAP0402]
C306  1000pF, 2kV  [CAP1812]
C307  470pF, 50V  Assembly Info: NF  [CAP0402]
C308  22uF, 10V  [CAP0603]
C309  22uF, 10V  [CAP0603]
C310  22uF, 10V  [CAP0603]
C311  22uF, 10V  [CAP0603]
C312  4.7uF, 6.3V  Assembly Info: NF  [CAP0402]
C313  4.7uF, 6.3V  Assembly Info: NF  [CAP0402]
C314  4.7uF, 6.3V  [CAP0402]
C315  4.7uF, 6.3V  [CAP0402]
C316  470pF, 50V  [CAP0402]
C317  470pF, 50V  [CAP0402]
C318  4.7uF, 6.3V  [CAP0402]
C319  4.7uF, 6.3V  [CAP0402]
C320  4.7uF, 6.3V  [CAP0402]
C321  4.7uF, 6.3V  [CAP0402]
C322  22uF, 10V  [CAP0603]
C323  22uF, 10V  [CAP0603]
C324  22uF, 10V  [CAP0603]
C325  10uF, 6.3V  [CAP0603]
C326  22uF, 10V  [CAP0603]
C327  470pF, 50V  [CAP0402]
C328  470pF, 50V  [CAP0402]
C329  1uF, 10V  [CAP0402]
C330  100nF, 16V  [CAP0402]
D1  MBR0530  [MBR0530T1G_shottky_diode_SOD123]
D2  MMSZ5245B  [MMSZ5245B_shottky_diode_SOD123]
D3  MMSZ5245B  [MMSZ5245B_shottky_diode_SOD123]
D4  MURA120  [MURA120T3G_diode_DO-214AC]
D5  MMSD4148T1G  [MMSD4148T1G_diode_SOD123]
D6  BAT54SLT1G  [BAT54SLT1G_SOT23-3]
D7  TLV431  [SOT23-5]
F1  Fiducial  [Fiducial]  (value not drawn)
F2  Fiducial  [Fiducial]  (value not drawn)
F3  Fiducial  [Fiducial]  (value not drawn)
F4  Fiducial  [Fiducial]  (value not drawn)
F5  Fiducial  [Fiducial]  (value not drawn)
F6  Fiducial  [Fiducial]  (value not drawn)
F7  Fiducial  [Fiducial]  (value not drawn)
F8  Fiducial  [Fiducial]  (value not drawn)
FR48  600R, 2A  [RES0805]
FR49  600R, 2A  [RES0805]
FR50  600R, 2A  Assembly Info: NF  [RES0805]
FR51  600R, 2A  [RES0805]
FR52  600R, 2A  [RES0805]
FR53  600R, 2A  [RES0805]
FR54  600R, 2A  [RES0805]
FR55  600R, 2A  [RES0805]
IC38  TPS23753APWR  [TPS23753APWR _TSSOP14]
IC39  LMZ10501  [LMZ10501]
IC40  LMZ10501  [LMZ10501]
IC41  AP7361-FGE  Assembly Info: NF  [AP7361]
IC42  AP7361-FGE  [AP7361]
IC43  AP7361-FGE  [AP7361]
IC44  AP7361-FGE  [AP7361]
IC45  LMZ10501  [LMZ10501]
IC46  LMZ10501  [LMZ10501]
J26  (no value)  [HDR_1x2]
J27  Header 3X2  [Header3x2]
J28  CONN_PWR_JACK_2.1x5.5mm  [CONN_PWR_JACK_v2]  (value not drawn)
JMP3  1 pcs.  (mechanical)
L2  10uH, 1.2A  [NRS4018T3R3MDGJ_inductor]
L3  3.3uH, 2.2A  [NRS4018T3R3MDGJ_inductor]
MECH5  # pcs.  [PCB_standoff]  (value not drawn)
MECH6  # pcs.  [PCB_standoff]  (value not drawn)
MECH7  # pcs.  [PCB_standoff]  (value not drawn)
MECH8  # pcs.  [PCB_standoff]  (value not drawn)
R199  10R, 1%  [RES0603]
R200  39k, 1%  [RES0805]
R201  10R, 1%  [RES0805]
R202  24.9k, 1%  [RES0402]
R203  0R  [RES0402]
R204  90.9R. 1%  [RES0603]
R205  20R 1%  [RES0805]
R206  680R, 1%  [RES0402]
R207  10k, 1%  [RES0402]
R208  44.2k, 1%  [RES0402]
R209  0R  [RES0402]
R210  80.6k, 1%  [RES0402]
R211  59k, 1%  [RES0402]
R212  10k, 1%  [RES0402]
R213  2k, 1%  [RES0402]
R214  14.3k, 1%  [RES0402]
R215  680R, 1%  [RES0402]
R216  10R, 1%  [RES0603]
R217  1k, 1%  [RES0402]
R218  0.5R, 1%  [RES1206]
R219  1k, 1%  Assembly Info: NF  [RES0402]
R220  560R, 1%  [RES0402]
R221  118k, 1%  [RES0402]
R222  118k, 1%  [RES0402]
R223  470R, 0.5%  Assembly Info: NF  [RES0402]
R224  1k, 1%  [RES0402]
R225  150k, 1%  [RES0402]
R226  150k, 1%  [RES0402]
R227  1.6k, 1%  [RES0402]
R228  750R, 1%  [RES0402]
R229  0R  [RES0402]
R230  0R  [RES0402]
R231  510R, 1%  [RES0402]
R232  1k, 1%  [RES0402]
R233  187k, 1%  [RES0402]
R234  187k, 1%  [RES0402]
R235  0R  Assembly Info: NF  [RES0805]
R236  82.5k, 1%  [RES0402]
R237  82.5k, 1%  [RES0402]
R238  0R  [RES0402]
R239  0R  Assembly Info: NF  [RES0805]
R240  0R  Assembly Info: NF  [RES0402]
R241  0R  Assembly Info: NF  [RES0805]
T5  NA6223-AL  [PoE13P-50L_Flyback_transformer]
VD3  SMAJ58A  [SMAJ58A_shottky_diode]
VD4  SMBJ5V0A  Assembly Info: NF  [SMAJ12CA-13-F]
VT8  CSD17527Q5A  [CSD17527Q5A_NMOS_8-VSONP]
VT9  SI4848DY  [SI4848DY_NMOS_SO8]
VT10  FDC86244  Assembly Info: NF  [SOT23-6]

### Nets
GND: C292.1 C293.1 C294.1 C295.1 C296.1 C305.1 C306.1 C308.1 C309.1 C310.1 C311.1 C312.1 C313.1 C314.1 C315.1 C316.2 C317.2 C318.1 C319.1 C320.1 C321.1 C322.1 C323.1 C324.1 C325.1 C326.1 C327.2 C328.2 C329.1 C330.2 D7.5(Anode) IC39.4(SGND) IC39.6(PGND) IC39.PAD(PAD_(SGND)) IC40.4(SGND) IC40.6(PGND) IC40.PAD(PAD_(SGND)) IC41.4(GND) IC41.9(PAD) IC42.4(GND) IC42.9(PAD) IC43.4(GND) IC43.9(PAD) IC44.4(GND) IC44.9(PAD) IC45.4(SGND) IC45.6(PGND) IC45.PAD(PAD_(SGND)) IC46.4(SGND) IC46.6(PGND) IC46.PAD(PAD_(SGND)) J26.1 J28.2 J28.3 MECH5.MH1 MECH6.MH1 MECH7.MH1 MECH8.MH1 R214.2 R223.2 R224.1 R225.1 R226.1 R231.2 R232.1 R236.1 R237.1 T5.10 VD4.A
POE_GND: AT1.3(Emitter) C286.2 C287.2 C288.1 C289.1 C299.1 C301.1 C302.2 C306.2 C307.2 IC38.6(RTN) R209.1 R210.2 R211.2 R218.2 T5.3
POE_VIN: C286.1 C287.1 C291.1 C298.2 FR48.2 IC38.8(VDD1) IC38.9(VDD) L2.1 R202.2 VD3.K
POE_VSS: C291.2 C298.1 FR49.2 IC38.7(VSS) R204.2 VD3.A
VCC1P4_LMS: C321.2 IC44.1(OUT) R228.1
VCC1P8: C324.2 IC46.3(FB) IC46.5(VOUT) R235.2
VCC1P8_2: C326.2 FR54.1 IC45.3(FB) IC45.5(VOUT) R235.1
VCC1P8_LMS: C325.2 FR51.1 FR53.1 FR54.2
VCC1P25_LMS: C315.2 IC42.1(OUT) R220.2
VCC2P5: C313.2 IC41.1(OUT) R219.2
VCC3P3: C309.2 IC39.3(FB) IC39.5(VOUT) R229.1 R230.1 R239.2 R240.2 R241.2
VCC3P3_2: C311.2 IC40.3(FB) IC40.5(VOUT) R239.1
VCC3P3_CLK: C319.2 IC43.1(OUT) R227.2 R238.1 R241.1
VCC3P3_RF: C329.2 C330.1 FR55.2
VCC5P0: C308.2 C310.2 C322.2 C323.2 FR50.1 FR52.1 IC39.7(VIN) IC40.7(VIN) IC45.7(VIN) IC46.7(VIN) J26.2 J27.2 J27.4 J27.6 VD4.K
VCC5P0_EXT: J27.3 J28.1
VCC5P0_POE: C292.2 C293.2 C296.2 J27.1 L3.2 R203.2
VCC5P0_USB_EXT: J27.5
POE1_DC+: BR1.2
POE1_DC-: BR1.4
POE2_DC+: BR2.2
POE2_DC-: BR2.4
POE_CS: C307.1 IC38.3(CS) R217.1
POE_CTL: AT1.4(Collector) C304.1 IC38.1(CTL) R213.2
POE_GATE: IC38.5(GATE) R216.2
POE_VB: C299.2 IC38.2(VB) R213.1 R215.1
POE_VC: C301.2 C302.1 D5.C IC38.4(VC)
NetAT1_1: AT1.1(Anode) R206.2
NetAT1_2: AT1.2(Cathode) C300.2 D6.A D7.3(Cathode) R212.1
NetBR1_1: BR1.1 BR2.1 C290.1 FR48.1
NetBR1_3: BR1.3 BR2.3 C290.2 FR49.1
NetC285_1: C285.1 D4.C R200.1
NetC285_2: C285.2 C288.2 C289.2 L2.2 R200.2 T5.2
NetC294_2: C294.2 C295.2 C297.1 L3.1 VT8.5(D) VT8.6(D) VT8.7(D) VT8.8(D)
NetC297_2: C297.2 R201.2
NetC300_1: C300.1 C303.1 D7.4(Reference) R208.1 R214.1
NetC303_2: C303.2 R212.2
NetC304_2: C304.2 R215.2
NetC305_2: C305.2 D6.A/C R207.2
NetC312_2: C312.2 FR50.2 IC41.5(EN) IC41.8(IN)
NetC314_2: C314.2 FR51.2 IC42.5(EN) IC42.8(IN)
NetC316_1: C316.1 IC39.2(VCON) R221.1 R225.2
NetC317_1: C317.1 IC40.2(VCON) R222.1 R226.2
NetC318_2: C318.2 FR52.2 IC43.5(EN) IC43.8(IN)
NetC320_2: C320.2 FR53.2 IC44.5(EN) IC44.8(IN)
NetC327_1: C327.1 IC45.2(VCON) R233.1 R236.2
NetC328_1: C328.1 IC46.2(VCON) R234.1 R237.2
NetD1_A: D1.A D2.C R199.1 VT8.4(G)
NetD1_C: D1.C R199.2 T5.6
NetD2_A: D2.A D3.A
NetD3_C: D3.C R201.1 T5.7 VT8.1(S) VT8.2(S) VT8.3(S)
NetD4_A: D4.A T5.1 VT9.5(D) VT9.6(D) VT9.7(D) VT9.8(D) VT10.1(D) VT10.2(D) VT10.5(D) VT10.6(D)
NetD5_A: D5.A R205.1
NetD6_C: D6.C R203.1 R206.1 R207.1 R208.2
NetFR55_1: FR55.1 R238.2 R240.1
NetIC38_10: IC38.10(DEN) R202.1
NetIC38_11: IC38.11(CLS) R204.1
NetIC38_12: IC38.12(APD) R209.2
NetIC38_13: IC38.13(BLNK) R210.1
NetIC38_14: IC38.14(FRS) R211.1
NetIC39_8: IC39.8(VREF) R221.2
NetIC40_8: IC40.8(VREF) R222.2
NetIC41_3: IC41.3(ADJ/NC) R219.1 R223.1
NetIC42_3: IC42.3(ADJ/NC) R220.1 R224.2
NetIC43_3: IC43.3(ADJ/NC) R227.1 R231.1
NetIC44_3: IC44.3(ADJ/NC) R228.2 R232.2
NetIC45_1: IC45.1(EN) R229.2
NetIC45_8: IC45.8(VREF) R233.2
NetIC46_1: IC46.1(EN) R230.2
NetIC46_8: IC46.8(VREF) R234.2
NetR205_2: R205.2 T5.4
NetR216_1: R216.1 VT9.4(G) VT10.3(G)
NetR217_2: R217.2 R218.1 VT9.1(S) VT9.2(S) VT9.3(S) VT10.4(S)

Not connected (* = marked no-connect by the designer): D7 1(NC)* 2(NC)*; F1 1*; F2 1*; F3 1*; F4 1*; F5 1*; F6 1*; F7 1*; F8 1*; IC39 1(EN)*; IC40 1(EN)*; IC41 2(NC)* 6(NC)* 7(NC)*; IC42 2(NC)* 6(NC)* 7(NC)*; IC43 2(NC)* 6(NC)* 7(NC)*; IC44 2(NC)* 6(NC)* 7(NC)*; JMP3 1 2; T5 5*

### Layout directives
net class VCC1P4_LMS: VCC1P4_LMS
net class VCC1P25_LMS: VCC1P25_LMS
net class VCC3P3_CLK: VCC3P3_CLK
net class VCC2P5: VCC2P5
net class VCC3P3_2: VCC3P3_2
net class VCC3P3: VCC3P3
net class VCC1P8: VCC1P8
net class VCC5P0: VCC5P0
net class VCC1P8_LMS: VCC1P8_LMS

### Notes on the sheet
- NF elements on sheet: VT10, C307, VD4, FR50, C312, IC41, R219, R223, C313, R235, R239, R240, R241
- Number of NF elements on sheet: 13
- Total number of NF elements on all sheets: 115
- Board power circuits
- Power over Ethernet
- Class 3, 13W Max, 36-57VDC, 10W PD
- IEEE 802.3-2005 compliant
- 5V, 2A
- (near IC38) 250kHz
- (near VT10) NF
- External power supply
- (near J28) Positive polarity
- (near J28) 5V (2-3A)
- Power source selection (5V)
- (near VD4) NF
- (near C307) NF
- PWR_SEL jumper position and source:
- 1-2: PoE
- Top
- Fiducials
- PCB standoffs
- (near JMP3) Default position: J27 pins 5-6
- 3-4: 5V external DC
- 5-6: 5V micro USB
- (near F5) Bottom
- Switching regulators
- (near IC39) FPGA, Periphs
- ERC rule exception:
- VCC3P3 connected to power and I/O pins
- (near IC40) ETH, RAPI, FTDI, WIFI
- Linear regulators
- Linear regulators (LMS)
- (near FR50) NF
- (near C313) NF
- RT
- (near IC40) ERC rule exception:
- (near IC40) VCC3P3_2 connected to power and I/O pins
- (near C312) NF
- (near IC41) NF
- (near R219) NF
- (near R223) NF
- (near C317) RB
- (near R235) NF
- (near R241) NF
- (near R239) NF
- (near R240) NF
- VCC3P3_CLK connected to power and I/O pins
- Project name:
- Title:
- Size:
- Date:
- A3
- Revision:
- Time:
- Sheet
- of
- File:
- (in symbol NA6223-AL_Flyback_transformer) Pri; W1B; Sync; W5; W1A; Sec; W3; Bias